# EAGLE design RSG_1_0 (EAGLE 7.6.0)
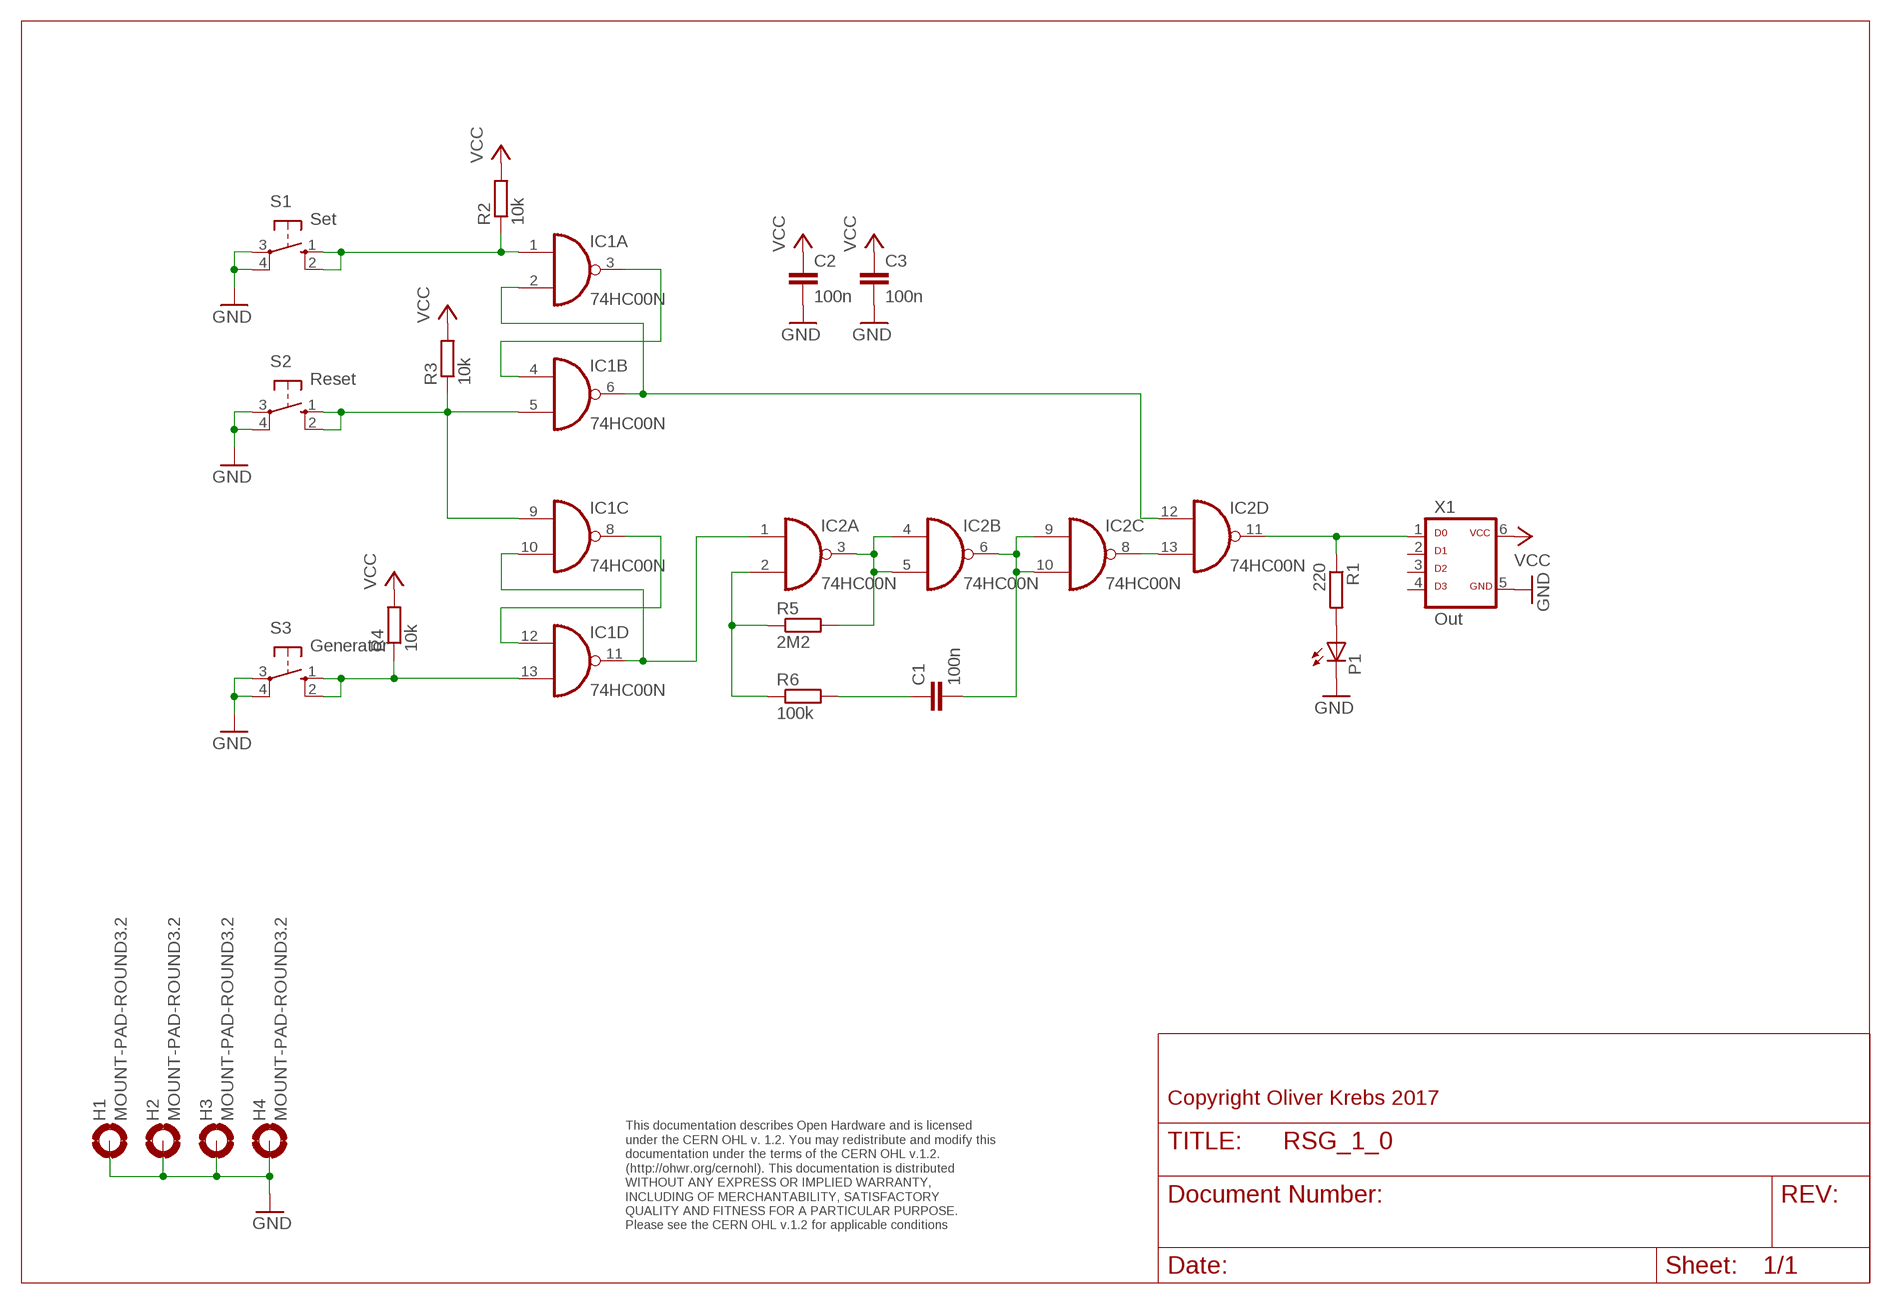
[diagram p0: schematic, sheet 1]

## Parts
C1  100n  C-EU050-025X075  [C050-025X075]
C2  100n  C-EU050-025X075  [C050-025X075]
C3  100n  C-EU050-025X075  [C050-025X075]
H1  MOUNT-PAD-ROUND3.2  [3,2-PAD]
H2  MOUNT-PAD-ROUND3.2  [3,2-PAD]
H3  MOUNT-PAD-ROUND3.2  [3,2-PAD]
H4  MOUNT-PAD-ROUND3.2  [3,2-PAD]
IC1  74HC00N  [DIL14]
IC2  74HC00N  [DIL14]
P1  LED3MM  [LED3MM]
R1  220  R-EU_0207/10  [0207/10]
R2  10k  R-EU_0207/10  [0207/10]
R3  10k  R-EU_0207/10  [0207/10]
R4  10k  R-EU_0207/10  [0207/10]
R5  2M2  R-EU_0207/10  [0207/10]
R6  100k  R-EU_0207/10  [0207/10]
S1  Set  10-XX  [B3F-10XX]
S2  Reset  10-XX  [B3F-10XX]
S3  Generator  10-XX  [B3F-10XX]
X1  Out  ML6D  [ML-6]

## Nets
GND: C2.2 C3.2 H1.B3,2(MOUNT) H2.B3,2(MOUNT) H3.B3,2(MOUNT) H4.B3,2(MOUNT) P1.K(C) S1.3(P) S1.4(P1) S2.3(P) S2.4(P1) S3.3(P) S3.4(P1) X1.5
N$1: IC1.1(A:I0) R2.1 S1.1(S) S1.2(S1)
N$2: IC1.2(A:I1) IC1.6(B:O) IC2.12(D:I0)
N$3: IC1.3(A:O) IC1.4(B:I0)
N$4: IC1.5(B:I1) IC1.9(C:I0) R3.1 S2.1(S) S2.2(S1)
N$5: IC1.13(D:I1) R4.1 S3.1(S) S3.2(S1)
N$6: IC1.10(C:I1) IC1.11(D:O) IC2.1(A:I0)
N$7: IC1.8(C:O) IC1.12(D:I0)
N$8: IC2.3(A:O) IC2.4(B:I0) IC2.5(B:I1) R5.2
N$9: P1.A R1.2
N$10: C1.2 IC2.6(B:O) IC2.9(C:I0) IC2.10(C:I1)
N$11: IC2.8(C:O) IC2.13(D:I1)
N$12: IC2.11(D:O) R1.1 X1.1
N$13: IC2.2(A:I1) R5.1 R6.1
N$14: C1.1 R6.2
VCC: C2.1 C3.1 R2.2 R3.2 R4.2 X1.6
Unconnected: X1.2 X1.3 X1.4

## Notes on the sheet
- Copyright Oliver Krebs 2017
- This documentation describes Open Hardware and is licensed 
  under the CERN OHL v. 1.2. You may redistribute and modify this 
  documentation under the terms of the CERN OHL v.1.2. 
  (http://ohwr.org/cernohl). This documentation is distributed
  WITHOUT ANY EXPRESS OR IMPLIED WARRANTY, 
  INCLUDING OF MERCHANTABILITY, SATISFACTORY 
  QUALITY AND FITNESS FOR A PARTICULAR PURPOSE. 
  Please see the CERN OHL v.1.2 for applicable conditions

## Power pins joined to a net without a drawn wire
GND: IC1.7(P:GND) IC2.7(P:GND)
VCC: IC1.14(P:VCC) IC2.14(P:VCC)

## Library data of the parts
C1-C3 = 01-my_rcl:C-EU: CAPACITOR, European symbol
H1-H4 = holes:MOUNT-PAD-ROUND: MOUNTING PAD, round
IC1 IC2 = 74xx-eu:74*00: Quad 2-input NAND gate
P1 = 01-my-led:LED: LED OSRAM: - CHIPLED LG R971, LG N971, LY N971, LG Q971, LY Q971, LO R971, LY R971 LH N974, LH R974 LS Q976, LO Q976, LY Q976 LO Q996 - Hyper CHIPLED LW Q18S LB Q993, LB Q99A, LB R99A - SideLED LS A670, LO A670, LY A670, LG A670, LP A670 LB A673, LV A673, LT A673, LW A673 LH A674 LY A675 LS A676, LA A676, LO A676, LY A676, LW A676 LS A679, LY A679, LG A679 - Hyper Micro SIDELED® LS Y876, LA Y876, LO Y876, LY Y876 LT Y87S - SmartLED LW L88C, LW L88S LB L89C, LB L89S, LG L890 LS L89K, LO L89K, LY L89K LS L896, LA L896, LO L896, LY L896 - TOPLED LS T670, LO T670, LY T670, LG T670, LP T670 LSG T670, LSP T670, LSY T670, LOP T670, LYG T670 LG T671, LOG T671, LSG T671 LB T673, LV T673, LT T673, LW T673 LH T674 LS T676, LA T676, LO T676, LY T676, LB T676, LH T676, LSB T676, LW T676 LB T67C, LV T67C, LT T67C, LS T67K, LO T67K, LY T67K, LW E67C LS E67B, LA E67B, LO E67B, LY E67B, LB E67C, LV E67C, LT E67C LW T67C LS T679, LY T679, LG T679 LS T770, LO T770, LY T770, LG T770, LP T770 LB T773, LV T773, LT T773, LW T773 LH T774 LS E675, LA E675, LY E675, LS T675 LS T776, LA T776, LO T776, LY T776, LB T776 LHGB T686 LT T68C, LB T68C - Hyper Mini TOPLED® LB M676 - Mini TOPLED Santana® LG M470 LS M47K, LO M47K, LY M47K Source: http://www.osram.convergy.de LUXEON: - LUMILED® LXK2-PW12-R00, LXK2-PW12-S00, LXK2-PW14-U00, LXK2-PW14-V00 LXK2-PM12-R00, LXK2-PM12-S00, LXK2-PM14-U00 LXK2-PE12-Q00, LXK2-PE12-R00, LXK2-PE12-S00, LXK2-PE14-T00, LXK2-PE14-U00 LXK2-PB12-K00, LXK2-PB12-L00, LXK2-PB12-M00, LXK2-PB14-N00, LXK2-PB14-P00, LXK2-PB14-Q00 LXK2-PR12-L00, LXK2-PR12-M00, LXK2-PR14-Q00, LXK2-PR14-R00 LXK2-PD12-Q00, LXK2-PD12-R00, LXK2-PD12-S00 LXK2-PH12-R00, LXK2-PH12-S00 LXK2-PL12-P00, LXK2-PL12-Q00, LXK2-PL12-R00 Source: www.luxeon.com KINGBRIGHT: KA-3528ASYC Source: www.kingbright.com
R1-R6 = 01-my_rcl:R-EU_: RESISTOR, European symbol
S1-S3 = switch-omron:10-XX: OMRON SWITCH; MPN: B3F-1000; OC_FARNELL: 176432; OC_NEWARK: 36M3542
X1 = 01-my-con:ML6D

## Board
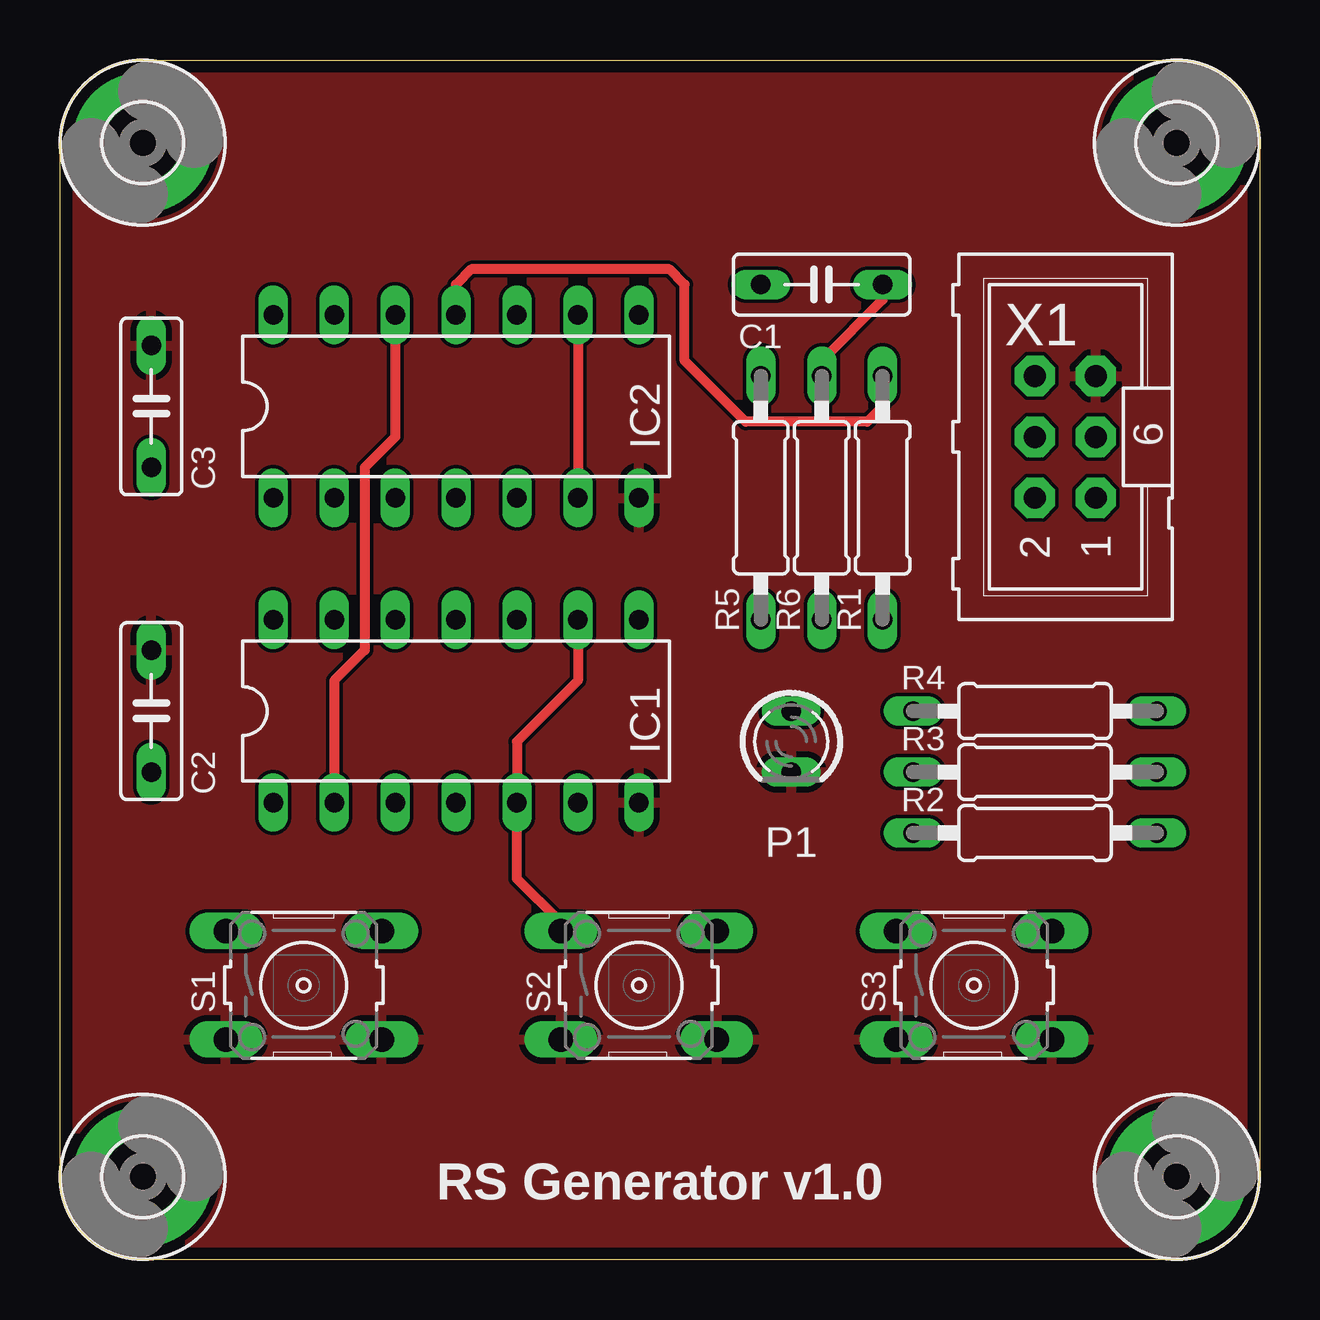
[diagram p1: board, top side]
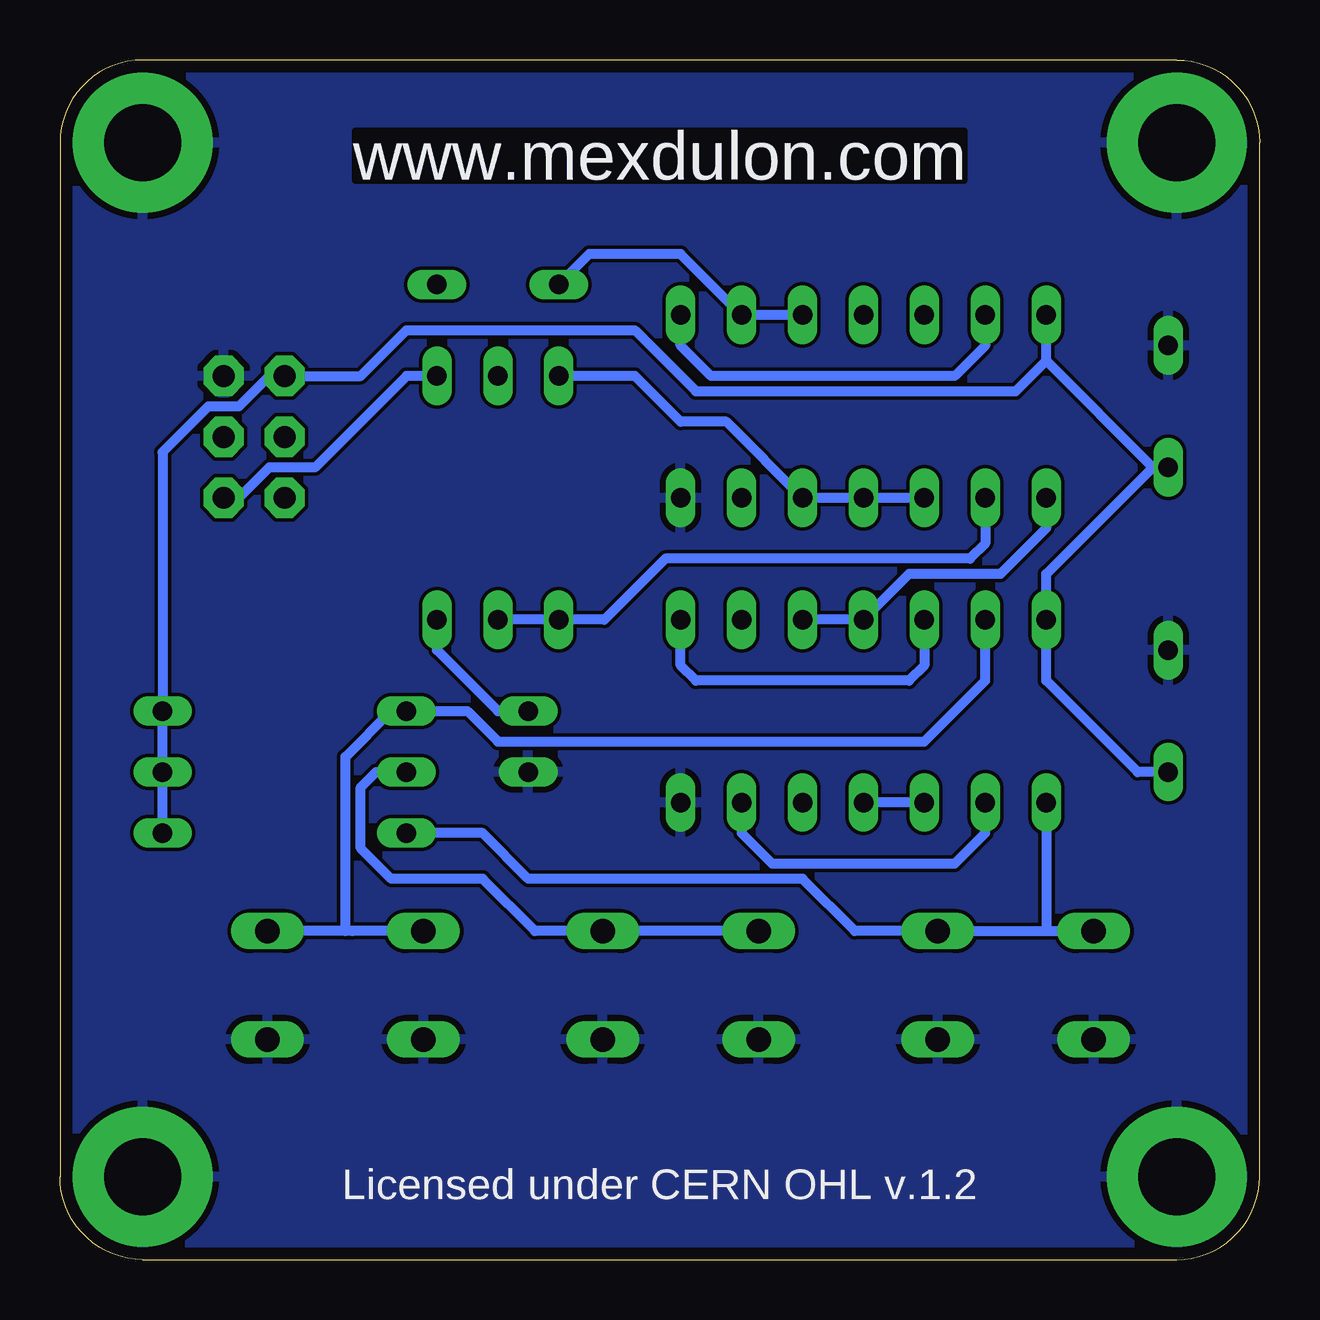
[diagram p2: board, bottom side, seen from below]

Size 50 x 50 mm. Coordinates in mm from the lower left corner, seen from the top.
Outline: 0,3.45 0,46.55 arc-90 3.45,50 46.55,50 arc-90 50,46.55 50,3.45 arc-90 46.55,0 3.45,0 arc-90 0,3.45
Copper layers (1*16): Top 0.035mm / dielectric 1.6mm / Bottom 0.035mm
Design rules "Elecrow_2-layer_PCB_eagle_rule": minimum track width 6mil, minimum drill 12mil, track to track 6mil, track to pad 6mil, pad to pad 6mil, via to via 8mil, smd to smd 0mil, copper to edge 20mil, drill to drill 10mil, minimum pad ring 6mil, minimum via ring 6mil, stop-mask expansion 0mil, vias tented up to drill 100mil, thermal gap 10mil

### Footprints (pad centres in the part's own frame; a part is rotated, then mirrored left to right if it is on the bottom)
C050-025X075 = drill 0.813 long: 1 -2.54,0; 2 2.54,0
3,2-PAD = drill 3.2 pad 5.842: B3,2 0,0
DIL14 = drill 0.813 long: 1 -7.62,-3.81; 2 -5.08,-3.81; 3 -2.54,-3.81; 4 0,-3.81; 5 2.54,-3.81; 6 5.08,-3.81; 7 7.62,-3.81; 8 7.62,3.81; 9 5.08,3.81; 10 2.54,3.81; 11 0,3.81; 12 -2.54,3.81; 13 -5.08,3.81; 14 -7.62,3.81
LED3MM = drill 0.813 long: A -1.27,0; K 1.27,0
0207/10 = drill 0.813 long: 1 -5.08,0; 2 5.08,0
B3F-10XX = drill 1.016 long: 1 -3.251,2.261; 2 3.251,2.261; 3 -3.251,-2.261; 4 3.251,-2.261
ML-6 = drill 0.914 pad 1.676 octagon: 1 -2.54,-1.27; 2 -2.54,1.27; 3 0,-1.27; 4 0,1.27; 5 2.54,-1.27; 6 2.54,1.27

### Placement (x,y rotation side)
C1  31.75,40.64 180 top
C2  3.81,22.86 90 top
C3  3.81,35.56 90 top
H1  3.45,3.45 0 top
H2  3.45,46.55 0 top
H3  46.55,3.45 0 top
H4  46.55,46.55 0 top
IC1  16.51,22.86 0 top
IC2  16.51,35.56 0 top
P1  30.48,21.59 270 top
R1  34.29,31.75 270 top
R2  40.64,17.78 0 top
R3  40.64,20.32 0 top
R4  40.64,22.86 0 top
R5  29.21,31.75 90 top
R6  31.75,31.75 90 top
S1  10.16,11.43 0 top
S2  24.13,11.43 0 top
S3  38.1,11.43 0 top
X1  41.91,34.29 90 top

### Tracks (layer width: path | path; a pad name or v marks a point on that pad's centre or on a via)
GND
  pour Bottom: 0,0 50.8,0 50.8,50.8 0,50.8
  pour Top: 0,50.16 50.16,50.16 50.16,0 0,0
N$1
  Bottom 0.406: 8.89,13.69 S1.2 16.87,13.69 19.05,15.88 30.48,15.88 32.38,17.78 R2.1 | 8.89,13.69 S1.1 | IC1.1 8.89,13.69
N$2
  Top 0.406: IC2.12 13.97,34.29 12.7,33.02 12.7,25.4 11.43,24.13 IC1.2
  Bottom 0.406: IC1.6 21.59,17.78 20.32,16.51 12.7,16.51 11.43,17.78 IC1.2
N$3
  Bottom 0.406: IC1.3 IC1.4
N$4
  Top 0.406: S2.1 20.88,14.05 19.05,15.88 IC1.5 19.05,21.59 21.59,24.13 IC1.9
  Bottom 0.406: S2.1 S2.2 30.2,13.69 32.38,15.88 36.2,15.88 37.47,17.14 37.47,19.68 36.83,20.32 R3.1
N$5
  Bottom 0.406: 38.1,13.69 S3.1 37.82,13.69 | 38.1,13.69 S3.2 | IC1.13 11.43,24.13 13.97,21.59 31.75,21.59 33.02,22.86 R4.1 36.2,22.86 38.1,20.95 38.1,13.69
N$6
  Bottom 0.406: IC1.10 IC1.11 14.61,28.57 10.79,28.57 8.89,30.48 IC2.1
N$7
  Bottom 0.406: IC1.12 13.97,24.77 14.61,24.13 23.5,24.13 24.13,24.77 IC1.8
N$8
  Bottom 0.406: IC2.3 IC2.4 IC2.5 22.23,34.92 24.13,34.92 26.04,36.83 R5.2
N$9
  Bottom 0.406: P1.A 31.75,22.86 34.29,25.4 R1.2
N$10
  Top 0.406: IC2.9 IC2.6
  Bottom 0.406: IC2.10 IC2.9 24.13,41.91 27.94,41.91 C1.2
N$11
  Bottom 0.406: IC2.13 11.43,38.1 12.7,36.83 22.86,36.83 24.13,38.1 IC2.8
N$12
  Top 0.406: R1.1 34.29,35.56 33.66,34.92 28.57,34.92 26.04,37.47 26.04,40.64 25.4,41.27 17.14,41.27 16.51,40.64 IC2.11
  Bottom 0.406: R1.1 35.56,36.83 39.37,33.02 41.27,33.02 42.55,31.75 X1.1
N$13
  Bottom 0.406: IC2.2 11.43,29.84 12.06,29.21 24.77,29.21 27.3,26.67 R5.1 R6.1
N$14
  Top 0.406: C1.1 34.29,40.01 31.75,37.47 R6.2
VCC
  Bottom 0.406: 8.89,37.47 IC2.14 | 8.89,37.47 10.16,36.2 23.5,36.2 26.04,38.73 35.56,38.73 37.47,36.83 X1.6 41.27,36.83 42.55,35.56 43.81,35.56 45.72,33.66 R4.2 R3.2 R2.2 | C2.1 5.08,20.32 8.89,24.13 IC1.14 8.89,28.57 4.45,33.02 | 4.45,33.02 C3.1 | 4.45,33.02 8.89,37.47

### Text on the board
Bottom: www.mexdulon.com
tNames: RS Generator v1.0
bNames: www.mexdulon.com | Licensed under CERN OHL v.1.2